# EAGLE schematic Schematic v17 (EAGLE 9.7.0)
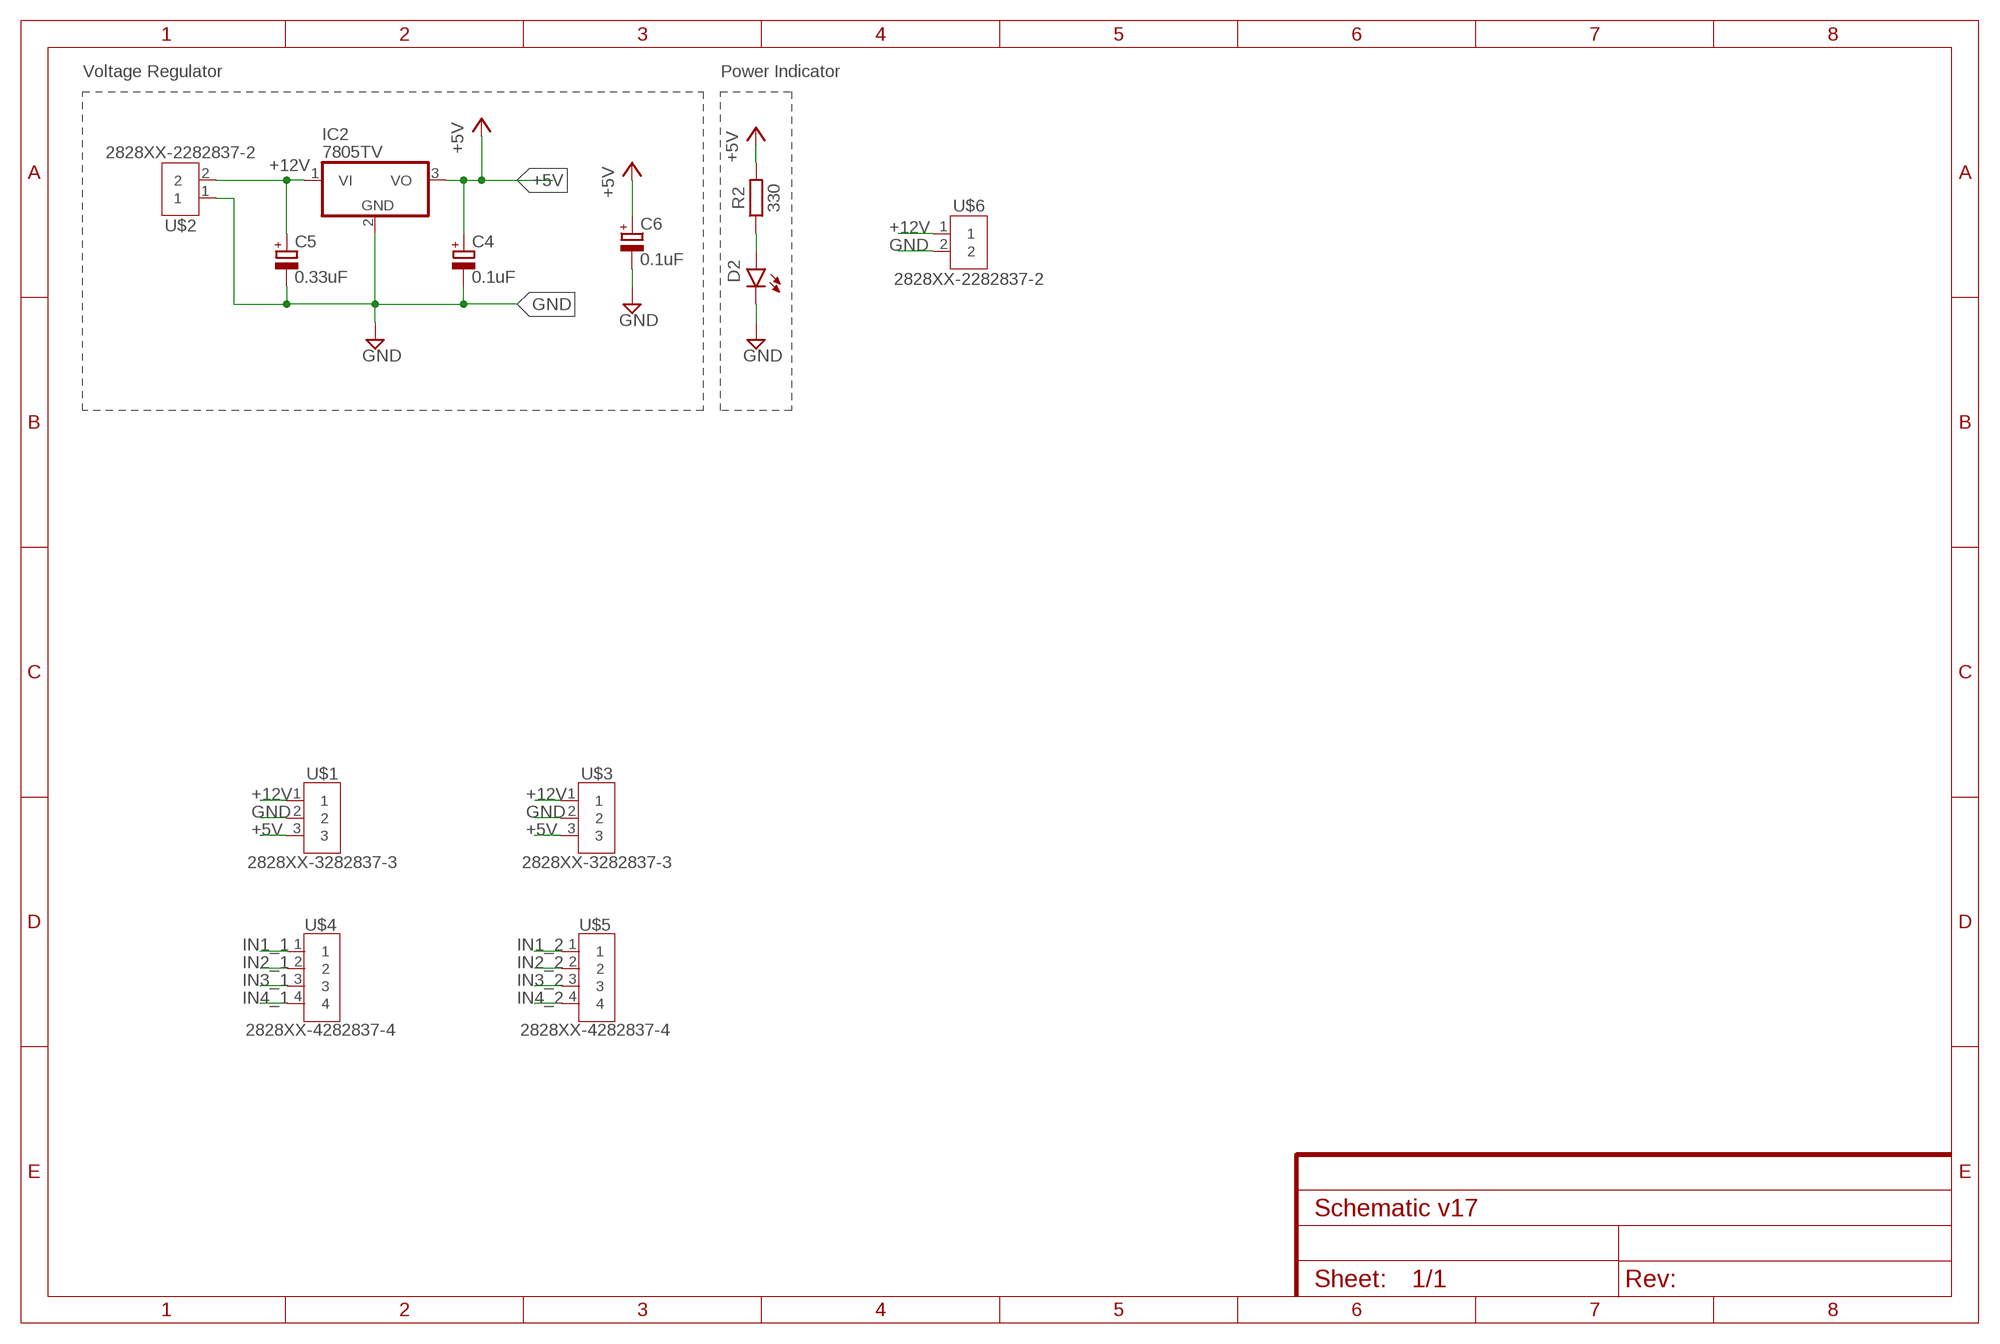
[diagram p0: schematic, sheet 1]

## Parts
C4  0.1uF  C-POL_RADIAL-11MM-DIA  [CAPPRD508W65D1000H1100B]
C5  0.33uF  C-POL_RADIAL-25MM-DIA  [CAPPRD550W110D1250H2500B]
C6  0.1uF  C-POL_RADIAL-11MM-DIA  [CAPPRD508W65D1000H1100B]
D2  LED_ORANGE  LED_RADIAL_ORANGE  [LEDRD254W60D565H860B_O]
IC2  7805TV  [TO220V]
R2  330  R_AXIAL-7.2MM-PITCH  [RESAD724W46L381D178B]
U$1  2828XX-3282837-3  [TERMBLK_508-3N]
U$2  2828XX-2282837-2  [TERMBLK_508-2N]
U$3  2828XX-3282837-3  [TERMBLK_508-3N]
U$4  2828XX-4282837-4  [TERMBLK_508-4N]
U$5  2828XX-4282837-4  [TERMBLK_508-4N]
U$6  2828XX-2282837-2  [TERMBLK_508-2N]

## Nets
+5V: C4.1(+) C6.1(+) IC2.3(VO) R2.2 U$1.3 U$3.3
+12V: C5.1(+) IC2.1(VI) U$1.1 U$2.2 U$3.1 U$6.1
GND: C4.2(-) C5.2(-) C6.2(-) D2.2(C) IC2.2(GND) U$1.2 U$2.1 U$3.2 U$6.2
IN1_1: U$4.1
IN1_2: U$5.1
IN2_1: U$4.2
IN2_2: U$5.2
IN3_1: U$4.3
IN3_2: U$5.3
IN4_1: U$4.4
IN4_2: U$5.4
N$1: D2.1(A) R2.1

## Notes on the sheet
- Voltage Regulator | Power Indicator

## Library data of the parts
C4-C6 = Capacitor:C-POL: Capacitor Polarised - Generic; CATEGORY: Capacitor
D2 = Tinkercad:LED_RADIAL: LED - Generic; CATEGORY: Opto-Electronic; SUB-CATEGORY: LED
IC2 = linear:78*: Positive VOLTAGE REGULATOR Source: http://cache.national.com/ds/LM/LM78L05.pdf http://www.fairchildsemi.com/ds/LM/LM7805.pdf
R2 = Resistor:R: Resistor Fixed - Generic; CATEGORY: Resistor; SUB-CATEGORY: Fixed
U$1 U$3 = Connector:2828XX-3: 3 Position Wire to Board Terminal Block Horizontal with Board Datasheet <https://www.te.com.cn/commerce/DocumentDelivery/DDEController?Action=showdoc&DocId=Catalog+Section%7F1308389_EUROSTYLE_TERMINAL_BLOCKS%7F0607%7Fpdf%7FEnglish%7FENG_CS_1308389_EUROSTYLE_TERMINAL_BLOCKS_0607.pdf%7F2-282837-5>; CATEGORY: Connector; DESCRIPTION: TERM BLK 3P SIDE ENT 5.08mm PCB; MANUFACTURER: TE Connectivity; MPN: 282837-3; OPERATING_TEMPERATURE: -40°C to +105°C; PART_STATUS: Active; ROHS_COMPLIANCE: RoHS Compliant; SERIES: 282837; SUBCATEGORY: Terminal Block; TYPE: Side Wire Entry
U$2 = Connector:2828XX-2: 2 Position Wire to Board Terminal Block Horizontal with Board Datasheet <https://www.te.com.cn/commerce/DocumentDelivery/DDEController?Action=showdoc&DocId=Catalog+Section%7F1308389_EUROSTYLE_TERMINAL_BLOCKS%7F0607%7Fpdf%7FEnglish%7FENG_CS_1308389_EUROSTYLE_TERMINAL_BLOCKS_0607.pdf%7F2-282837-5>; CATEGORY: Connector; DESCRIPTION: 2 Position Wire to Board Terminal Block Horizontal with Board 5.08 mm Through Hole; MANUFACTURER: TE Connectivity; MPN: 282837-2; OPERATING_TEMPERATURE: -40°C to +105°C; PART_STATUS: ACTIVE; ROHS_COMPLIANCE: RoHS Compliant; SERIES: 282837; SPICEPREFIX: B; SUBCATEGORY: Terminal Block; TYPE: Side Wire Entry
U$4 U$5 = Connector:2828XX-4: 4 Position Wire to Board Terminal Block Horizontal with Board Datasheet <https://www.te.com.cn/commerce/DocumentDelivery/DDEController?Action=showdoc&DocId=Catalog+Section%7F1308389_EUROSTYLE_TERMINAL_BLOCKS%7F0607%7Fpdf%7FEnglish%7FENG_CS_1308389_EUROSTYLE_TERMINAL_BLOCKS_0607.pdf%7F2-282837-5>; CATEGORY: Connector; DESCRIPTION: TERM BLK 4P SIDE ENT 5.08mm PCB; MANUFACTURER: TE Connectivity; MPN: 282837-4; OPERATING_TEMPERATURE: 40°C to +105°C; PART_STATUS: Active; ROHS_COMPLIANCE: RoHS Compliant; SERIES: 283737; SUBCATEGORY: Terminal Block; TYPE: Side Wire Entry
U$6 = Connector:2828XX-2: 2 Position Wire to Board Terminal Block Horizontal with Board Datasheet <https://www.te.com.cn/commerce/DocumentDelivery/DDEController?Action=showdoc&DocId=Catalog+Section%7F1308389_EUROSTYLE_TERMINAL_BLOCKS%7F0607%7Fpdf%7FEnglish%7FENG_CS_1308389_EUROSTYLE_TERMINAL_BLOCKS_0607.pdf%7F2-282837-5>; CATEGORY: Connector; DESCRIPTION: 2 Position Wire to Board Terminal Block Horizontal with Board 5.08 mm Through Hole; MANUFACTURER: TE Connectivity; MPN: 282837-2; OPERATING_TEMPERATURE: -40°C to +105°C; PART_STATUS: ACTIVE; ROHS_COMPLIANCE: RoHS Compliant; SERIES: 282837; SUBCATEGORY: Terminal Block; TYPE: Side Wire Entry